# EasyEDA Pro project TM_fan_driver.eprj

# Schematic Schematic1
Board Name: Board1; Create Date: 2026-05-11; Page Name: P1; Project Name: TM_fan_driver; Schematic Name: Schematic1; Update Date: 2026-05-11; Company: EasyEDA.com; Page Size: A4; Version: V1.0
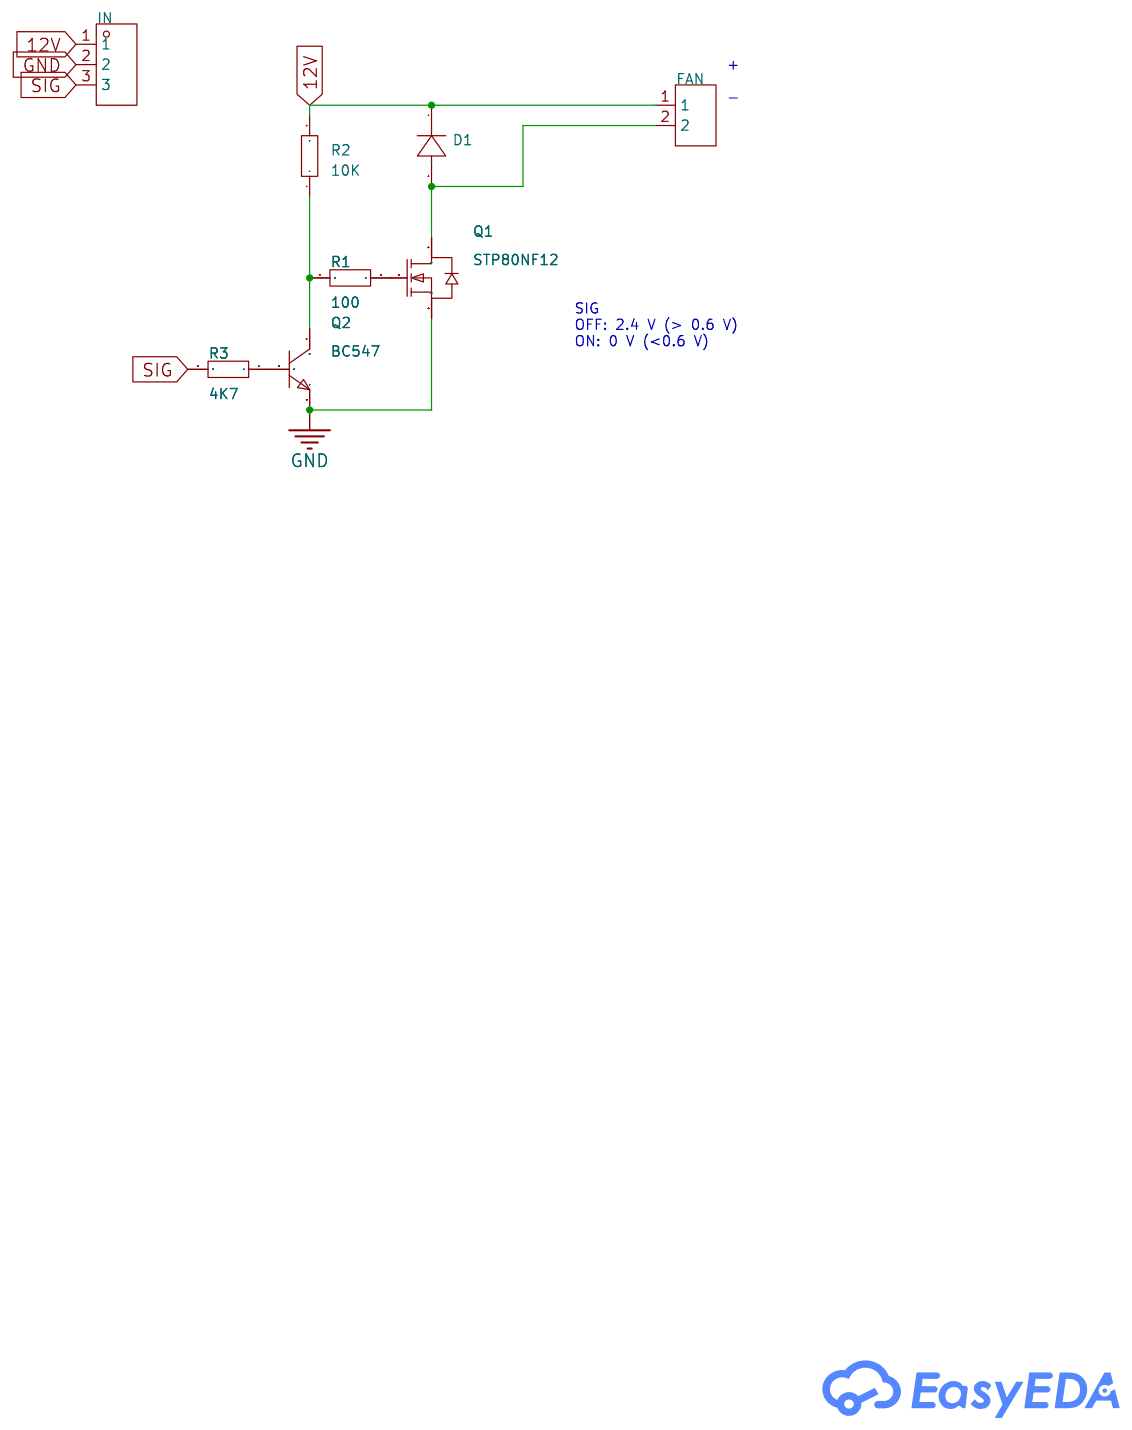
[diagram p0: schematic sheet]

## Parts
D1  -  [SMA_L4.4-W2.8-LS5.4-RD]
FAN  XY-B2B-PH-K-S  [CONN-TH_B2B-PH-K-S]
IN  B3B-PH-KL(LF)(SN)  [CONN-TH_B3B-PH-KL-LF-SN]
Q1  STP80NF12  [TO-220-3_L10.0-W4.5-P2.54-L]
Q2  BC547  [TO-92-3_L4.9-W3.7-P1.27-L]
R1  100  [R0603]
R2  10K  [R0603]
R3  4K7  [R0603]

## Library data of the parts
D1 = 1N4007: Supplier Footprint: SMA(DO-214AC); Supplier Part: C727081
FAN = XY-B2B-PH-K-S: LCSC Part Name: 1x2P 间距:2mm; Supplier Part: C51940125; Manufacturer: XYECONN(辛译); Supplier Footprint: 插件,P=2mm; JLCPCB Part Class: Extended Part; Supplier: LCSC; Pins Structure: 1x2P; Pitch: 2mm; Number of Pins: 2P; Number of Rows: 1; Number of PINs Per Row: 2; Current Rating: 2A; Contact Material: Brass; Contact Plating: Tin; Operating Temperature: -25℃~+85℃; Voltage Rating: 250V; Plastic Material: PA66; Flame Retardant Rating: UL94V-0; Color: White
IN = B3B-PH-KL(LF)(SN): LCSC Part Name: 1x3P 间距:2mm 直插 系列:PH; Supplier Part: C158004; Manufacturer: JST; Supplier Footprint: 插件,P=2mm; JLCPCB Part Class: Extended Part; Datasheet: https://item.szlcsc.com/datasheet/B3B-PH-KL(LF)(SN)/169352.html; Supplier: LCSC; Pins Structure: 1x3P; Pitch: 2mm; Mounting Type: Through Hole; Reference Series: PH; Number of Pins: 3P; Number of Rows: 1; Number of PINs Per Row: 3; Current Rating: 2A; Contact Material: Copper Alloy; Contact Plating: Tin; Operating Temperature: -25℃~+85℃; Voltage Rating: 100V; Plastic Material: PA66; Flame Retardant Rating: UL94V-0; Supplementary Features: K Pin; Color: Gray; Z-Height of the Board: 6mm; X-Length of Bottom Edge on Board (Spacing Line): 7.9mm; Y-Width of Bottom Edge on Board: 4.5mm
Q1 = STP80NF12: LCSC Part Name: 1个N沟道 耐压:120V 电流:80A; Supplier Part: C457463; Manufacturer: ST(意法半导体); Supplier Footprint: TO-220; JLCPCB Part Class: Extended Part; Datasheet: https://item.szlcsc.com/datasheet/STP80NF12/461057.html; Supplier: LCSC; Number: 1 N-Channel; Drain to Source Voltage: 120V; Current - Continuous Drain(Id): 80A; RDS(on): 13mΩ@10V,40A; Pd - Power Dissipation: 300W; Gate Threshold Voltage (Vgs(th)): 4V; Gate Charge(Qg): 189nC@80V; Input Capacitance(Ciss): 4.3nF; Reverse Transfer Capacitance (Crss@Vds): 230pF; Operating Temperature: -55℃~+175℃
Q2 = BC547: Supplier Part: C47089404; Manufacturer: CJ(江苏长电/长晶); Supplier Footprint: TO-92; JLCPCB Part Class: Extended Part; Datasheet: https://item.szlcsc.com/datasheet/BC547/49277194.html; Supplier: LCSC; type: NPN; Current - Collector(Ic): 100mA; Collector - Emitter Voltage VCEO: 45V; Pd - Power Dissipation: 625mW; DC Current Gain: 800@5V,2mA; Transition frequency(fT): 150MHz; Current - Collector Cutoff: 100nA; Vce Saturation(VCE(sat)): 300mV@100mA,5mA; Operating Temperature: -55℃~+150℃; Emitter-Base Voltage(Vebo): 6V; Number: 1 NPN
R1-R3 = Res_0603: Supplier Footprint: 0603

## Nets
12V: D1.1(K) FAN.1 IN.1 R2.2
GND: IN.2 Q1.3(S) Q2.3(E)
SIG: IN.3 R3.2
Net-(D1-2): D1.2(A) FAN.2 Q1.2(D)
Net-(Q1-1): Q1.1(G) R1.2
Net-(Q2-1): Q2.1(C) R1.1 R2.1
Net-(Q2-2): Q2.2(B) R3.1

## Notes on the sheet
- +
  -
- SIG
  OFF: 2.4 V (> 0.6 V)
  ON: 0 V (<0.6 V)
